# Altium schematic sheet 04_MCU.SchDoc
size A4; SheetNumber: 4; SheetTotal: 5
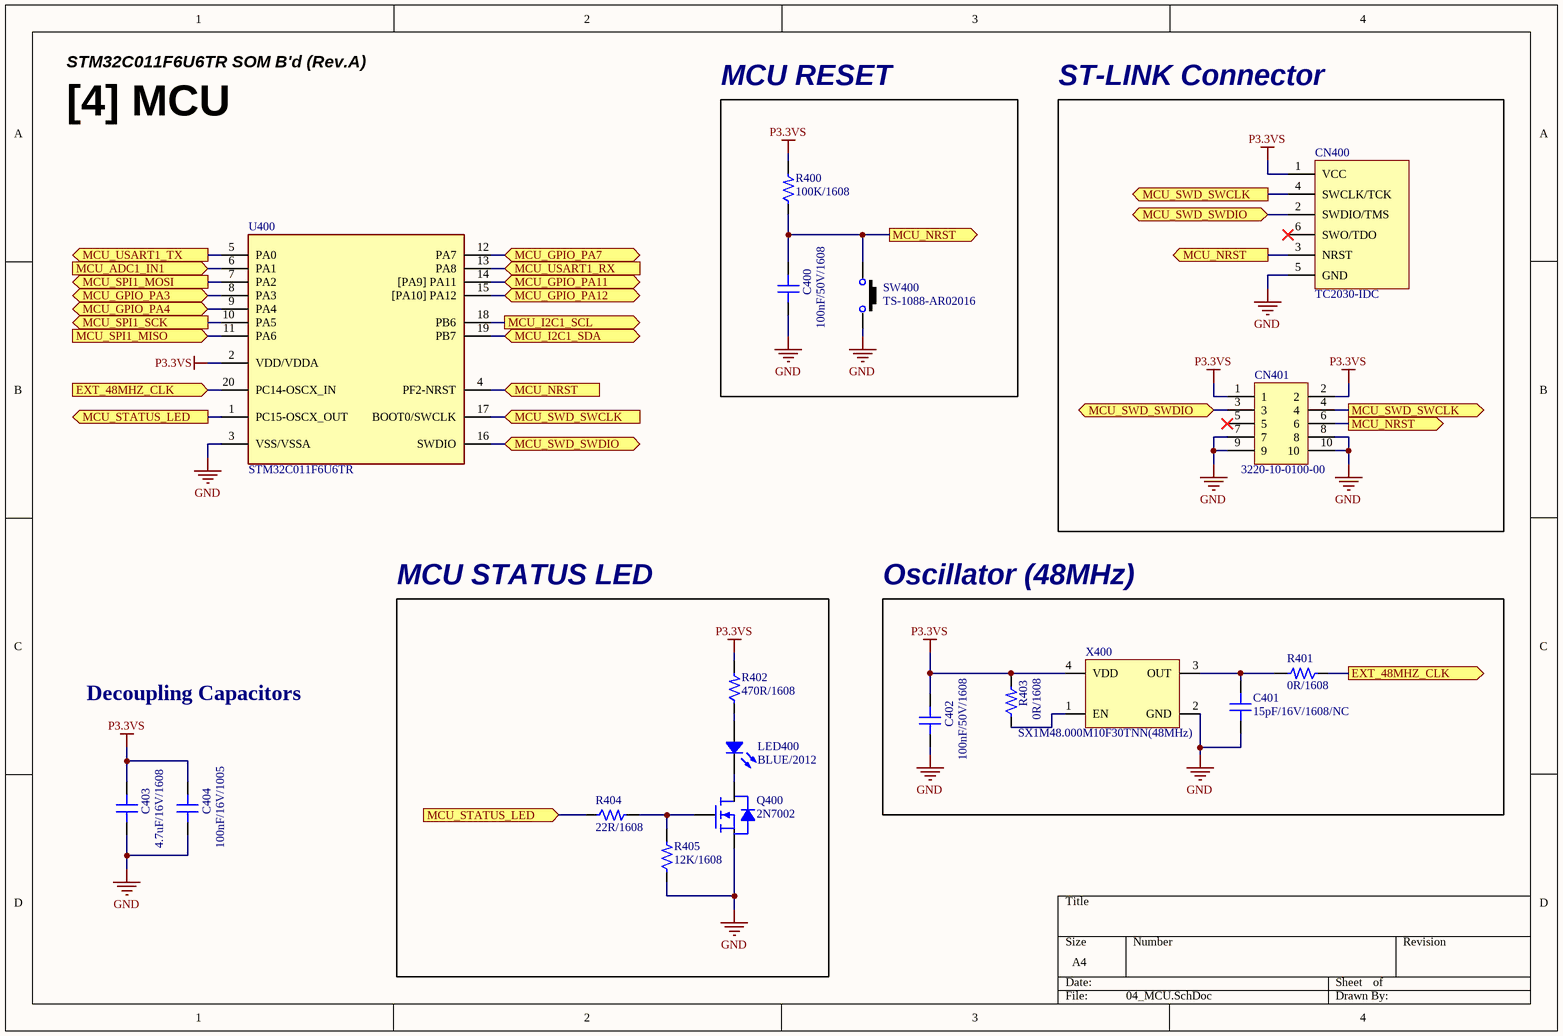
[diagram p0: 04_MCU.SchDoc]

## Parts
C400  100nF/50V/1608  [CAP 1608 (0603_INCH)]
C401  15pF/16V/1608/NC  [CAP 1608 (0603_INCH)/NC]
C402  100nF/50V/1608  [CAP 1608 (0603_INCH)]
C403  4.7uF/16V/1608  [CAP 1608 (0603_INCH)]
C404  100nF/16V/1005  [CAP 1005 (0402_INCH)]
CN400  TC2030-IDC  [CON_TC2030-FP]  (no BOM)
CN401  3220-10-0100-00  [CON 3220-10-0100-00 (Hand_Solder)]
LED400  BLUE/2012  [LED MHT170RGBCT (BLUE)]
Q400  2N7002  [SOT 23-3 (DIODES INCORPORATED)]
R400  100K/1608  [RES 1608 (0603_inch)]
R401  0R/1608  [RES 1608 (0603_inch)]
R402  470R/1608  [RES 1608 (0603_inch)]
R403  0R/1608  [RES 1608 (0603_inch)]
R404  22R/1608  [RES 1608 (0603_inch)]
R405  12K/1608  [RES 1608 (0603_inch)]
SW400  TS-1088-AR02016  [SW_TS-1088-AR02016]
U400  STM32C011F6U6TR  [IC_UFQFPN-20]
X400  SX1M48.000M10F30TNN(48MHz)  [OSC_SMD2016-4P]

## Blocks framed on the sheet
MCU RESET: C400 R400 SW400
ST-LINK Connector: CN400 CN401
MCU STATUS LED: LED400 Q400 R402 R404 R405
Oscillator (48MHz): C401 C402 R401 R403 X400

## Ports
EXT_48MHZ_CLK (in), EXT_48MHZ_CLK (out), MCU_ADC1_IN1 (in), MCU_GPIO_PA3 (bidir), MCU_GPIO_PA4 (bidir), MCU_GPIO_PA7 (bidir), MCU_GPIO_PA11 (bidir), MCU_GPIO_PA12 (bidir), MCU_I2C1_SCL (out), MCU_I2C1_SDA (bidir), MCU_NRST (in), MCU_NRST (out), MCU_SPI1_MISO (in), MCU_SPI1_MOSI (out), MCU_SPI1_SCK (out), MCU_STATUS_LED (in), MCU_STATUS_LED (out), MCU_SWD_SWCLK (in), MCU_SWD_SWCLK (out), MCU_SWD_SWDIO (bidir), MCU_USART1_RX (in), MCU_USART1_TX (out)

## Nets
GND: C400.1 C401.1 C402.1 C403.1 C404.1 CN400.5(GND) CN401.7 CN401.8 CN401.9 CN401.10 Q400.2(S) R405.1 SW400.2 U400.3(VSS/VSSA) X400.2(GND)
P3.3VS: C402.2 C403.2 C404.2 CN400.1(VCC) CN401.1 CN401.2 R400.2 R402.2 R403.2 U400.2(VDD/VDDA) X400.4(VDD)
EXT_48MHZ_CLK: R401.1 U400.20(PC14-OSCX_IN) ; port EXT_48MHZ_CLK
MCU_ADC1_IN1: U400.6(PA1) ; port MCU_ADC1_IN1
MCU_GPIO_PA3: U400.8(PA3) ; port MCU_GPIO_PA3
MCU_GPIO_PA4: U400.9(PA4) ; port MCU_GPIO_PA4
MCU_GPIO_PA7: U400.12(PA7) ; port MCU_GPIO_PA7
MCU_GPIO_PA11: U400.14([PA9]_PA11) ; port MCU_GPIO_PA11
MCU_GPIO_PA12: U400.15([PA10]_PA12) ; port MCU_GPIO_PA12
MCU_I2C1_SCL: U400.18(PB6) ; port MCU_I2C1_SCL
MCU_I2C1_SDA: U400.19(PB7) ; port MCU_I2C1_SDA
MCU_NRST: C400.2 CN400.3(NRST) CN401.6 R400.1 SW400.1 U400.4(PF2-NRST) ; port MCU_NRST
MCU_SPI1_MISO: U400.11(PA6) ; port MCU_SPI1_MISO
MCU_SPI1_MOSI: U400.7(PA2) ; port MCU_SPI1_MOSI
MCU_SPI1_SCK: U400.10(PA5) ; port MCU_SPI1_SCK
MCU_STATUS_LED: R404.1 U400.1(PC15-OSCX_OUT) ; port MCU_STATUS_LED
MCU_SWD_SWCLK: CN400.4(SWCLK/TCK) CN401.4 U400.17(BOOT0/SWCLK) ; port MCU_SWD_SWCLK
MCU_SWD_SWDIO: CN400.2(SWDIO/TMS) CN401.3 U400.16(SWDIO) ; port MCU_SWD_SWDIO
MCU_USART1_RX: U400.13(PA8) ; port MCU_USART1_RX
MCU_USART1_TX: U400.5(PA0) ; port MCU_USART1_TX
NetC401_2: C401.2 R401.2 X400.3(OUT)
NetLED400_3: LED400.3(BLUE) Q400.3(D)
NetLED400_4: LED400.4(Common_Anode) R402.1
NetQ400_1: Q400.1(G) R404.2 R405.2
NetR403_1: R403.1 X400.1(EN)

Not connected (* = marked no-connect by the designer): CN400 6(SWO/TDO)*; CN401 5*

## Notes on the sheet
- STM32C011F6U6TR SOM B'd (Rev.A)
- [4] MCU
- Decoupling Capacitors

## Library data of the parts
C400 C402 = CAP_100nF/50V/1608: Ceramic CAP_100nF/50V/1608; LCSC Part #: C14663; JLCPCB Part Type: Basic Part
C401 = CAP_NC_15pF/16V/1608: Ceramic CAP_15pF/16V/1608
C403 = CAP_4.7uF/16V/1608: Ceramic CAP_4.7uF/16V/1608; LCSC Part #: C19666; JLCPCB Part Type: Basic Part
C404 = CAP_100nF/16V/1005: Ceramic CAP_100nF/16V/1005; LCSC Part #: C1525; JLCPCB Part Type: Basic Part
CN400 = CON_TC2030-IDC: Tag-Connect No-Solder SWD Debug Connector DO NOT PLACE; Manufacturer Part Number: TC2030; Manufacturer: Tag-Connect
CN401 = CON_IDC_3220-10-0100-00: CONN HEADER VERT 10POS 1.27MM
LED400 = LED_MHT170RGBCT(BLUE): Colorless transparence -30℃~+85℃ Positive post Common anode RGB 120° 0805  Light Emitting Diodes (LED) ROHS; LCSC Part #: C2962094; JLCPCB Part Type: Extended Part
Q400 = FET_2N7002: 60V 115mA 200mW 7.5Ω@10V,500mA N Channel SOT-23  MOSFETs ROHS; LCSC Part #: C8545; JLCPCB Part Type: Basic Part
R400 = RES_100K/1608/0.1W: Value: 100K; Power Rating: 0.1W; Precision: 1%; Size: 1608; LCSC Part #: C25803; JLCPCB Part Type: Basic Part
R401 R403 = RES_0R/1608/0.1W: Value: 0R; Power Rating: 0.1W; Precision: 1%; Size: 1608; LCSC Part #: C21189; JLCPCB Part Type: Basic Part
R402 = RES_470R/1608/0.1W: Value: 470R; Power Rating: 0.1W; Precision: 1%; Size: 1608; LCSC Part #: C23179; JLCPCB Part Type: Basic Part
R404 = RES_22R/1608/0.1W: Value: 22R; Power Rating: 0.1W; Precision: 1%; Size: 1608; LCSC Part #: C23345; JLCPCB Part Type: Basic Part
R405 = RES_12K/1608/0.1W: Value: 12K; Power Rating: 0.1W; Precision: 1%; Size: 1608; LCSC Part #: C22790; JLCPCB Part Type: Basic Part
SW400 = SW_TS-1088-AR02016: NO 50mA 100MΩ 100000 Times 12V 160gf@±50gf Brick nogging SPST SMD  Tactile Switches ROHS; LCSC Part #: C720477; JLCPCB Part Type: Extended Part
U400 = IC_MCU_STM32C011F6U6TR: ARM® Cortex®-M0+ STM32C0 Microcontroller IC 32-Bit 48MHz 32KB (32K x 8) FLASH 20-UFQFPN (3x3); Manufacturer: STMicroelectronics; Manufacturer Part Number: STM32C011F6U6TR; Case/Package: UFQFPN20; LCSC Part #: C5456206; JLCPCB Part Type: Extended Part
X400 = OSC_SX1M48.000M10F30TNN(48MHz): 1.62V~3.63V ±10ppm CMOS 48MHz SMD2016-4P  Oscillators ROHS; LCSC Part #: C2901617; JLCPCB Part Type: Extended Part